# Altium schematic sheet PLD_RadFET_Sensor.SchDoc: 24-bit AD7714YRZ Analog-to-Digital Converter
size A4; Revision: 1; SheetTotal: 32; Model: DM1
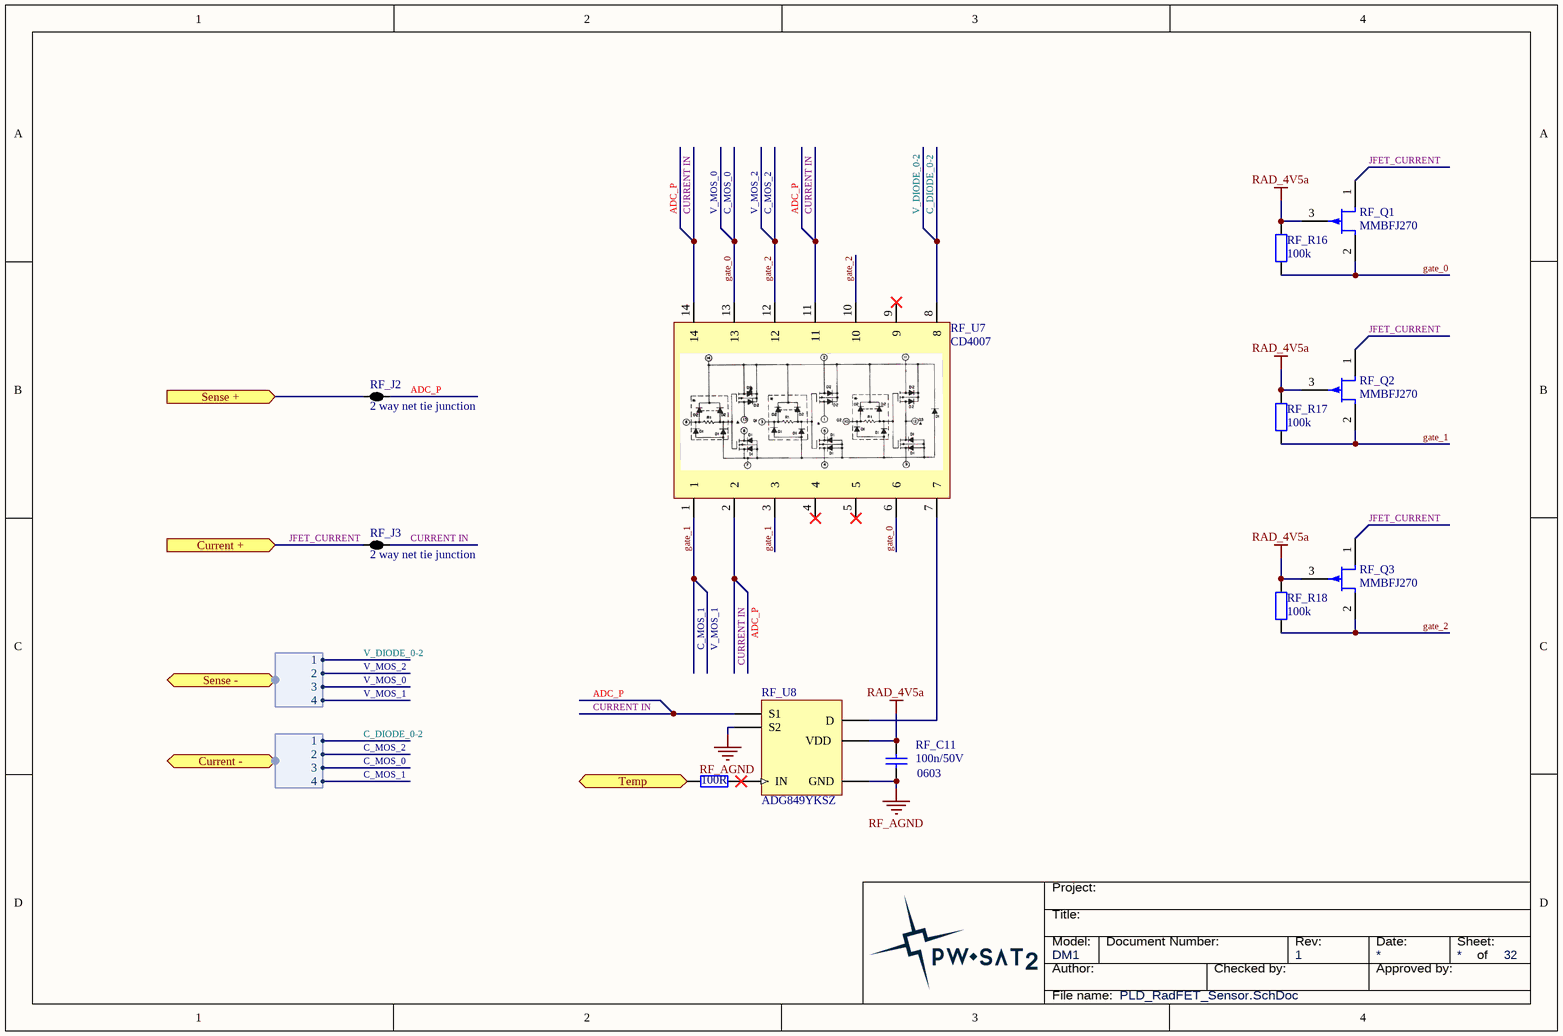
[diagram p0: PLD_RadFET_Sensor.SchDoc]

## Parts
RF_C11  Package: 0603  [SMD_Capacitor_0603]  (hidden comment: 100n/50V)
RF_J2  2 way net tie junction  [2way_LP]  (net tie, no BOM)
RF_J3  2 way net tie junction  [2way_LP]  (net tie, no BOM)
RF_Q1  MMBFJ270  [SOT23-3]
RF_Q2  MMBFJ270  [SOT23-3]
RF_Q3  MMBFJ270  [SOT23-3]
RF_R7  100R  [SMD_Resistor_0603]
RF_R16  100k  [SMD_Resistor_0603]
RF_R17  100k  [SMD_Resistor_0603]
RF_R18  100k  [SMD_Resistor_0603]
RF_U7  CD4007  [TSSOP14]
RF_U8  ADG849YKSZ  [SC70-LT6_N]

## Ports
Current + (in), Current - (harness ADG709_MUX_CH), Sense + (in), Sense - (harness ADG709_MUX_CH), Temp (in)

## Harnesses
ADG709_MUX_CH: 1, 2, 3, 4

## Nets
RAD_4V5a: RF_C11.1 RF_Q1.3(G) RF_Q2.3(G) RF_Q3.3(G) RF_R16.2 RF_R17.2 RF_R18.2 RF_U8.2(VDD)
RF_AGND: RF_C11.2 RF_U8.3(GND) RF_U8.6(S2)
ADC_P: RF_J2.2 RF_J3.2 RF_U7.2 RF_U7.11 RF_U7.14 RF_U8.4(S1)  [also labelled CURRENT IN]
C_DIODE_0-2: RF_U7.8 ; port Sense -.1, port Current -.1  [also labelled V_DIODE_0-2]
C_MOS_0: RF_Q1.2(S) RF_R16.1 RF_U7.6 RF_U7.13 ; port Sense -.3, port Current -.3  [also labelled gate_0, V_MOS_0]
C_MOS_1: RF_Q2.2(S) RF_R17.1 RF_U7.1 RF_U7.3 ; port Sense -.4, port Current -.4  [also labelled gate_1, V_MOS_1]
C_MOS_2: RF_Q3.2(S) RF_R18.1 RF_U7.10 RF_U7.12 ; port Sense -.2, port Current -.2  [also labelled gate_2, V_MOS_2]
JFET_CURRENT: RF_J3.1 RF_Q1.1(D) RF_Q2.1(D) RF_Q3.1(D) ; port Current +
Sense +: RF_J2.1 ; port Sense +
Temp: RF_R7.1 ; port Temp
NetRF_R7_2: RF_R7.2 RF_U8.1(IN)
NetRF_U7_7: RF_U7.7 RF_U8.5(D)

Not connected (* = marked no-connect by the designer): RF_U7 4* 5* 9*

## Notes on the sheet
- Title:
- Project:
- Author:
- Model:
- Document Number:
- Checked by:
- Rev:
- Date:
- Approved by:
- Sheet:
- of
- File name:

## Library data of the parts
RF_C11 = Cer_C0603T104K5RALTU: Ceramic Cap Kemet COTS 100n/50V X7R 0603; Manufacturer: Kemet; ManufacturerPartNumber: C0603T104K5RALTU; Value: 100n/50V
RF_J2 RF_J3 = 2way: ComponentLink1URL: http://www.edatools.cz/addons; ComponentLink1Description: Source; FootprintNote: LP=12mil, MP=40mil, HP=120mil
RF_Q1-RF_Q3 = MMBFJ270: JFET, P-Channel, 3-Pin SOT-23, Pb-Free, Tape and Reel; Manufacturer: On Semiconductor; PackageDescription: 3-Pin Small Outline Transistor, Body 2.92 x 1.3 mm, Pitch 0.95 mm; RoHS: Pb-Free; Mounting Technology: Surface Mount; PartNumber: MMBFJ270; ComponentLink1Description: Manufacturer URL; ComponentLink1URL: http://www.onsemi.com/; ComponentLink2Description: Datasheet; ComponentLink2URL: http://www.onsemi.com/pub_link/Collateral/MMBFJ177LT1-D.PDF; ComponentLink3Description: Package Specification
RF_R7 RF_R16-RF_R18 = Res: Package: 0603
  RF_R7: Value: 100R
  RF_R16-RF_R18: Value: 100k
RF_U7 = CD4007: CMOS Dual Complementary Pair Plus Inverter; ComponentLink1URL: http://www.mouser.com/catalog/specsheets/AT45DB041D.pdf; ComponentLink1Description: Datasheet
RF_U8 = ADG849YKSZ: CMOS Analog switch; Manufacturer: Analog Devices; ManufacturerPartNumber: ADG849YKSZ